# Altium schematic sheet Schematicfile.SchDoc
size A3; SheetNumber: 5; SheetTotal: 5
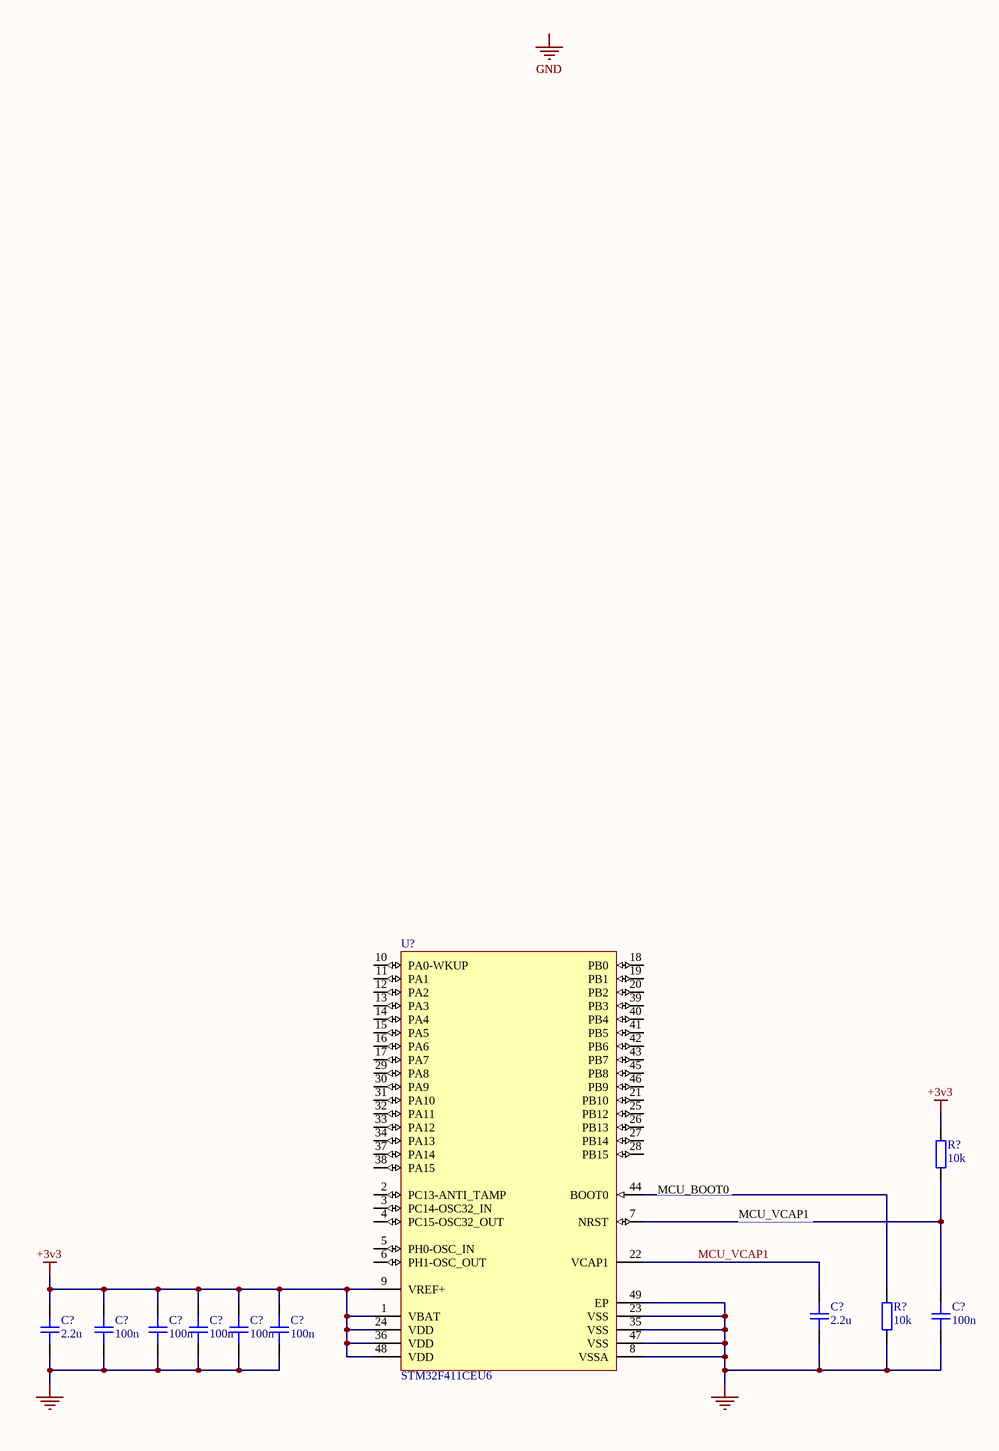
[diagram p0: Schematicfile.SchDoc]

## Parts
(Parts that share a designator on the sheet are numbered #1, #2 ... from top to bottom, then left to right.)
C?#1  2.2u  [CAP_0603]
C?#2  100n  [CAP_0402]
C?#3  2.2u  [CAP_0603]
C?#4  100n  [CAP_0402]
C?#5  100n  [CAP_0402]
C?#6  100n  [CAP_0402]
C?#7  100n  [CAP_0402]
C?#8  100n  [CAP_0402]
R?#1  10k  [RES_0402]
R?#2  10k  [RES_0402]
U?  STM32F411CEU6  [STM-UFQFPN48_L]

## Nets
+3v3: C?#3.2 C?#4.2 C?#5.2 C?#6.2 C?#7.2 C?#8.2 R?#1.2 U?.1(VBAT) U?.9(VREF+) U?.24(VDD) U?.36(VDD) U?.48(VDD)
GND: C?#1.1 C?#2.1 C?#3.1 C?#4.1 C?#5.1 C?#6.1 C?#7.1 C?#8.1 R?#2.1 U?.8(VSSA) U?.23(VSS) U?.35(VSS) U?.47(VSS) U?.49(EP)
MCU_VCAP1: C?#1.2 U?.22(VCAP1)
NetC?#2_2: C?#2.2 R?#1.1 U?.7(NRST)
NetR?#2_2: R?#2.2 U?.44(BOOT0)

Not connected (* = marked no-connect by the designer): U? 2(PC13-ANTI_TAMP) 3(PC14-OSC32_IN) 4(PC15-OSC32_OUT) 5(PH0-OSC_IN) 6(PH1-OSC_OUT) 10(PA0-WKUP) 11(PA1) 12(PA2) 13(PA3) 14(PA4) 15(PA5) 16(PA6) 17(PA7) 18(PB0) 19(PB1) 20(PB2) 21(PB10) 25(PB12) 26(PB13) 27(PB14) 28(PB15) 29(PA8) 30(PA9) 31(PA10) 32(PA11) 33(PA12) 34(PA13) 37(PA14) 38(PA15) 39(PB3) 40(PB4) 41(PB5) 42(PB6) 43(PB7) 45(PB8) 46(PB9)

## Notes on the sheet
- (near U?) MCU_BOOT0
- MCU_VCAP1

## Library data of the parts
C?#1 C?#3 = CAP_0603_16V: Capacitor SMD 0603 16V
C?#2 C?#4-C?#8 = CAP_0402_16V: Capacitor SMD 0402 16V
R?#1 R?#2 = RES_0402: Resistor SMD 0402
U? = CMP-0243-00165-1: ARM Cortex-M4 32-bit MCU+FPU, 512 KB Flash, 128 KB RAM, 36 I/Os, 48-Pin UFQFPN, -40 to 85 degC, Tray; Operating Frequency(F) (Processor speed) (MHz): 100; FLASH Size (Prog) (kB): 512; Internal RAM Size (kB): 128; I/Os (High Current): 36; Supply Voltage(Vcc) min (V): 1.7; Package Reference: 48-Pin Ultra Thin Fine Pitch Quad Flat No-Lead, 7 x 7 x 0.6 mm Body, 0.5 mm Pitch, Exposed Pad; ComponentLink1Description: Manufacturer URL; ComponentLink1URL: http://www.st.com/; Packing: Tray; Package Description: UFQFPN48; Core: ARM Cortex-M4; ComponentLink2Description: Datasheet; ComponentLink2URL: http://www.st.com/st-web-ui/static/active/en/resource/technical/document/datasheet/DM00115249.pdf; DatasheetVersion: Rev. 6; Mounting Technology: Surface Mount